# Altium schematic sheet Power.SchDoc
size A3; SheetNumber: 3; SheetTotal: 10
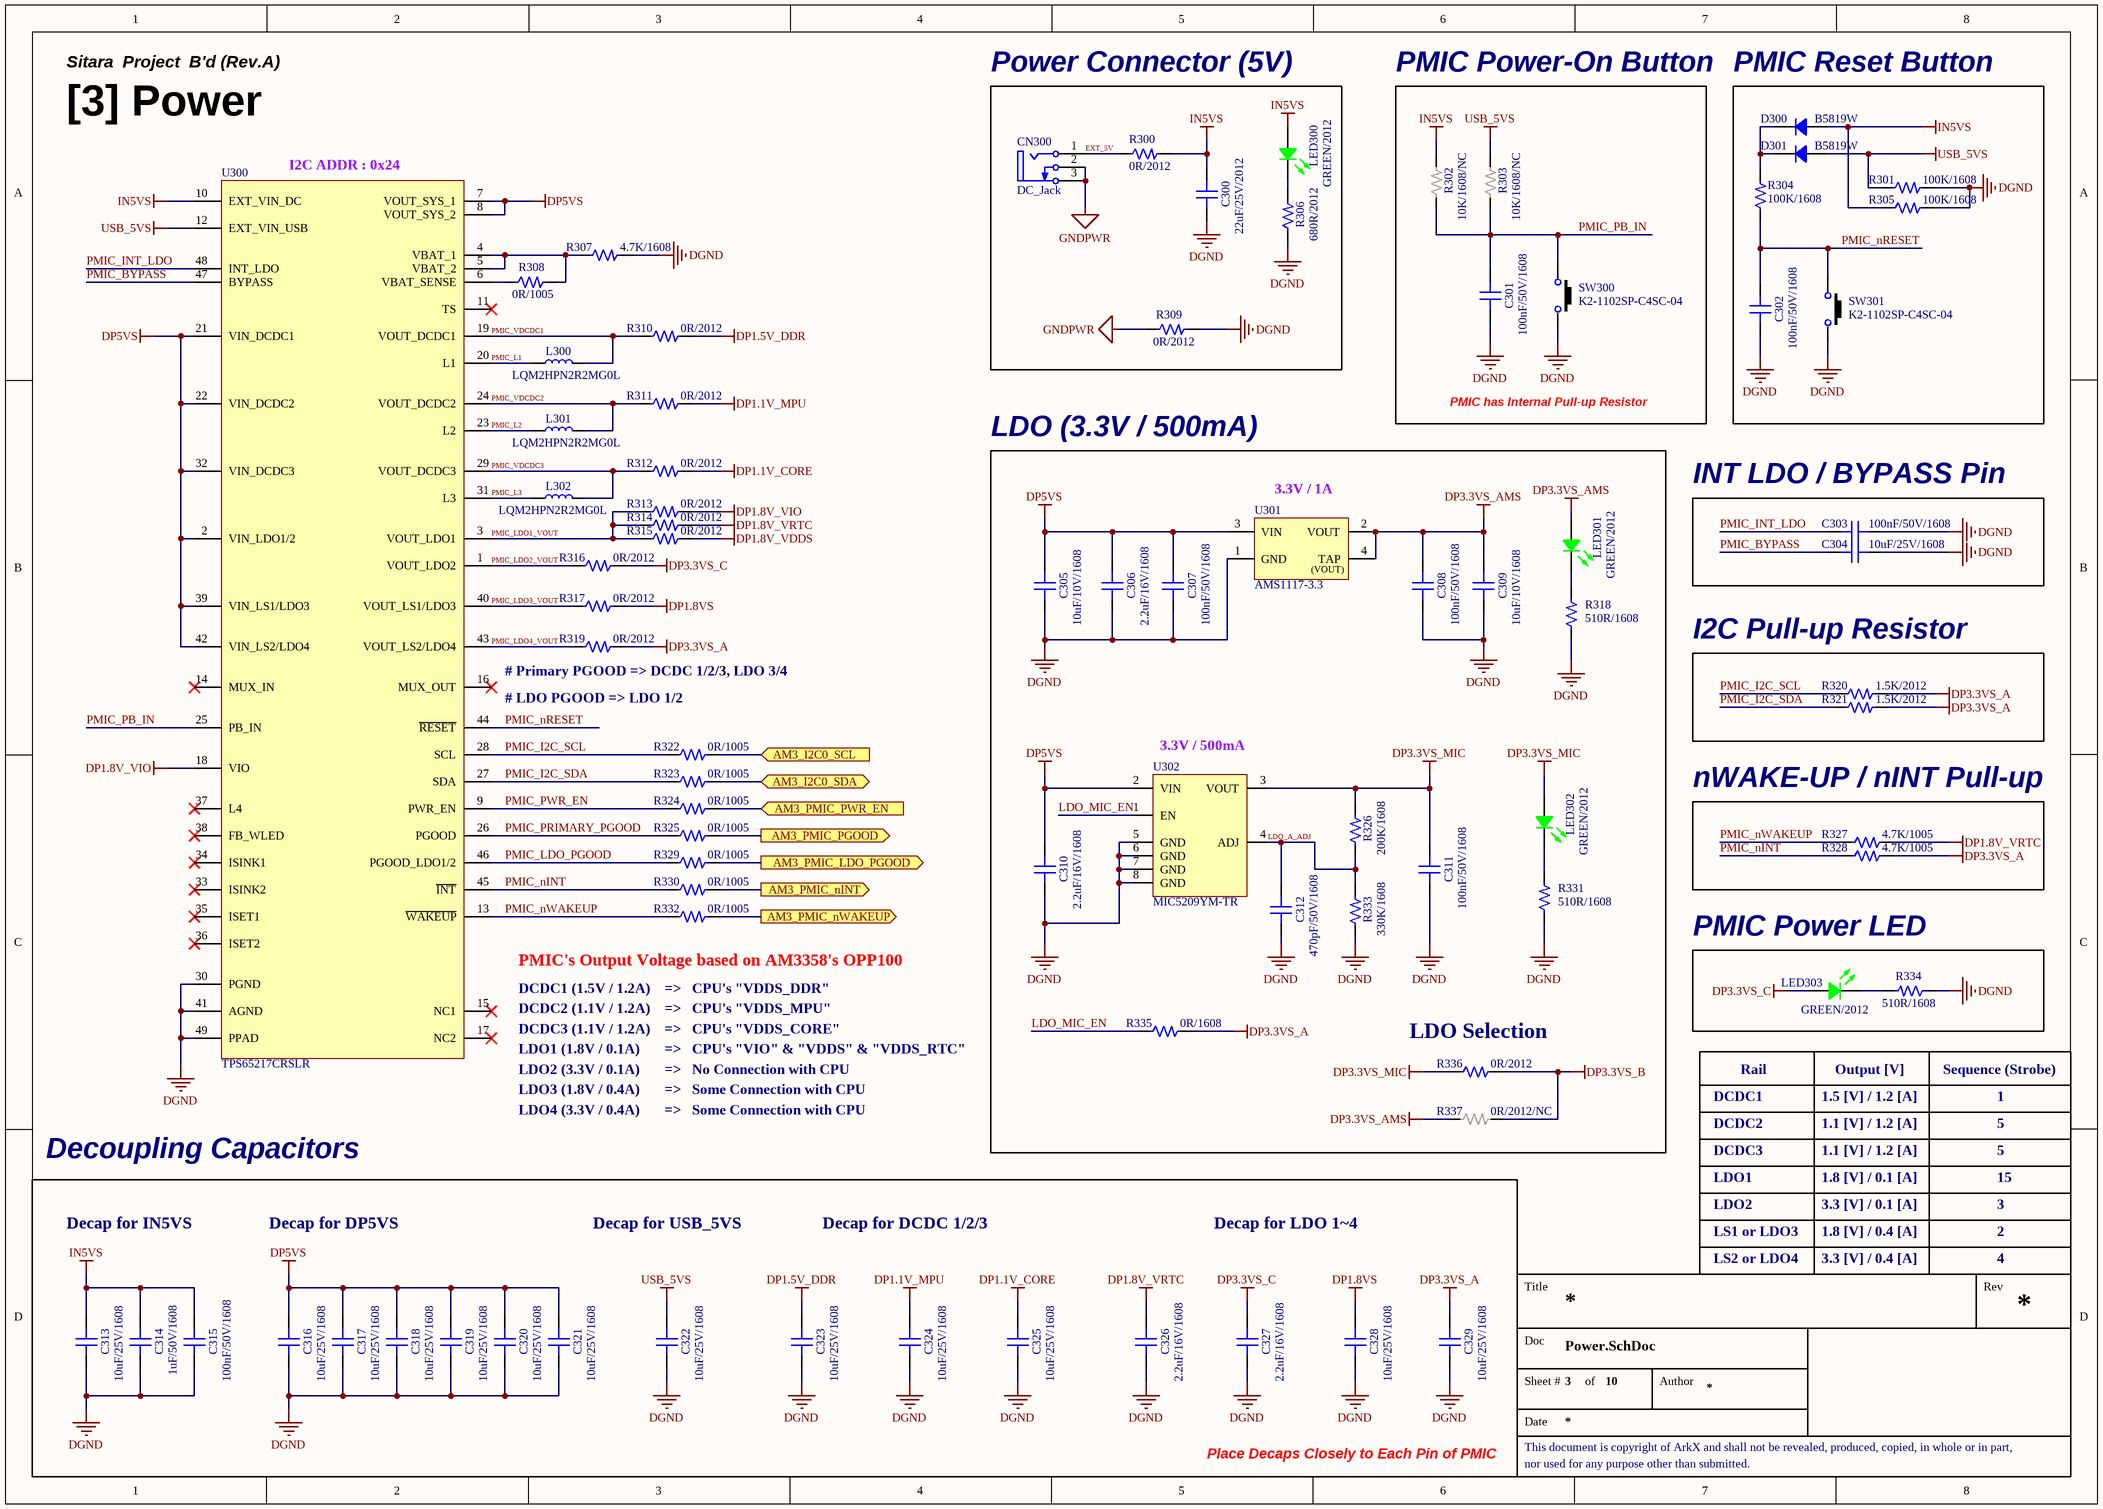
[diagram p0: Power.SchDoc]

## Parts
C300  22uF/25V/2012  [CAP 2012 (0805_INCH)]
C301  100nF/50V/1608  [CAP 1608 (0603_INCH)]
C302  100nF/50V/1608  [CAP 1608 (0603_INCH)]
C303  100nF/50V/1608  [CAP 1608 (0603_INCH)]
C304  10uF/25V/1608  [CAP 1608 (0603_INCH)]
C305  10uF/10V/1608  [CAP 1608 (0603_INCH)]
C306  2.2uF/16V/1608  [CAP 1608 (0603_INCH)]
C307  100nF/50V/1608  [CAP 1608 (0603_INCH)]
C308  100nF/50V/1608  [CAP 1608 (0603_INCH)]
C309  10uF/10V/1608  [CAP 1608 (0603_INCH)]
C310  2.2uF/16V/1608  [CAP 1608 (0603_INCH)]
C311  100nF/50V/1608  [CAP 1608 (0603_INCH)]
C312  470pF/50V/1608  [CAP 1608 (0603_INCH)]
C313  10uF/25V/1608  [CAP 1608 (0603_INCH)]
C314  1uF/50V/1608  [CAP 1608 (0603_INCH)]
C315  100nF/50V/1608  [CAP 1608 (0603_INCH)]
C316  10uF/25V/1608  [CAP 1608 (0603_INCH)]
C317  10uF/25V/1608  [CAP 1608 (0603_INCH)]
C318  10uF/25V/1608  [CAP 1608 (0603_INCH)]
C319  10uF/25V/1608  [CAP 1608 (0603_INCH)]
C320  10uF/25V/1608  [CAP 1608 (0603_INCH)]
C321  10uF/25V/1608  [CAP 1608 (0603_INCH)]
C322  10uF/25V/1608  [CAP 1608 (0603_INCH)]
C323  10uF/25V/1608  [CAP 1608 (0603_INCH)]
C324  10uF/25V/1608  [CAP 1608 (0603_INCH)]
C325  10uF/25V/1608  [CAP 1608 (0603_INCH)]
C326  2.2uF/16V/1608  [CAP 1608 (0603_INCH)]
C327  2.2uF/16V/1608  [CAP 1608 (0603_INCH)]
C328  10uF/25V/1608  [CAP 1608 (0603_INCH)]
C329  10uF/25V/1608  [CAP 1608 (0603_INCH)]
CN300  DC_Jack  [CON_DC-JACK]
D300  B5819W  [DIO_SOD-123]
D301  B5819W  [DIO_SOD-123]
L300  LQM2HPN2R2MG0L  [IND_LQM2HPN2R2MG0L]
L301  LQM2HPN2R2MG0L  [IND_LQM2HPN2R2MG0L]
L302  LQM2HPN2R2MG0L  [IND_LQM2HPN2R2MG0L]
LED300  GREEN/2012  [LED MHT170RGBCT (GREEN)]
LED301  GREEN/2012  [LED MHT170RGBCT (GREEN)]
LED302  GREEN/2012  [LED MHT170RGBCT (GREEN)]
LED303  GREEN/2012  [LED MHT170RGBCT (GREEN)]
R300  0R/2012  [RES 2012 (0805_inch)]
R301  100K/1608  [RES 1608 (0603_inch)]
R302  10K/1608/NC  [RES 1608 (0603_inch)/NC]
R303  10K/1608/NC  [RES 1608 (0603_inch)/NC]
R304  100K/1608  [RES 1608 (0603_inch)]
R305  100K/1608  [RES 1608 (0603_inch)]
R306  680R/2012  [RES 2012 (0805_inch)]
R307  4.7K/1608  [RES 1608 (0603_inch)]
R308  0R/1005  [RES 1005 (0402_inch)]
R309  0R/2012  [RES 2012 (0805_inch)]
R310  0R/2012  [RES 2012 (0805_inch)]
R311  0R/2012  [RES 2012 (0805_inch)]
R312  0R/2012  [RES 2012 (0805_inch)]
R313  0R/2012  [RES 2012 (0805_inch)]
R314  0R/2012  [RES 2012 (0805_inch)]
R315  0R/2012  [RES 2012 (0805_inch)]
R316  0R/2012  [RES 2012 (0805_inch)]
R317  0R/2012  [RES 2012 (0805_inch)]
R318  510R/1608  [RES 1608 (0603_inch)]
R319  0R/2012  [RES 2012 (0805_inch)]
R320  1.5K/2012  [RES 2012 (0805_inch)]
R321  1.5K/2012  [RES 2012 (0805_inch)]
R322  0R/1005  [RES 1005 (0402_inch)]
R323  0R/1005  [RES 1005 (0402_inch)]
R324  0R/1005  [RES 1005 (0402_inch)]
R325  0R/1005  [RES 1005 (0402_inch)]
R326  200K/1608  [RES 1608 (0603_inch)]
R327  4.7K/1005  [RES 1005 (0402_inch)]
R328  4.7K/1005  [RES 1005 (0402_inch)]
R329  0R/1005  [RES 1005 (0402_inch)]
R330  0R/1005  [RES 1005 (0402_inch)]
R331  510R/1608  [RES 1608 (0603_inch)]
R332  0R/1005  [RES 1005 (0402_inch)]
R333  330K/1608  [RES 1608 (0603_inch)]
R334  510R/1608  [RES 1608 (0603_inch)]
R335  0R/1608  [RES 1608 (0603_inch)]
R336  0R/2012  [RES 2012 (0805_inch)]
R337  0R/2012/NC  [RES 2012 (0805_INCH)/NC]
SW300  K2-1102SP-C4SC-04  [SW K2-1102SP-C4SC-04]
SW301  K2-1102SP-C4SC-04  [SW K2-1102SP-C4SC-04]
U300  TPS65217CRSLR  [IC_VQFN-48(6x6)]
U301  AMS1117-3.3  [SOT 223-3 (DIODES INCORPORATED)]
U302  MIC5209YM-TR  [IC_SOIC-8 (4.90x3.90mm)]

## Blocks framed on the sheet
Power Connector (5V): C300 CN300 LED300 R300 R306 R309
PMIC Power-On Button: C301 R302 R303 SW300
PMIC Reset Button: C302 D300 D301 R301 R304 R305 SW301
LDO (3.3V / 500mA): C305-C312 LED301 LED302 R318 R326 R331 R333 R335-R337 U301 U302
INT LDO / BYPASS Pin: C303 C304
I2C Pull-up Resistor: R320 R321
nWAKE-UP / nINT Pull-up: R327 R328
PMIC Power LED: LED303 R334
Decoupling Capacitors: C313-C329

## Ports
AM3_I2C0_SCL (in, see Sitara_IO_Bank_6[2B], Sitara_IO_Bank_123[4A]), AM3_I2C0_SDA (bidir, see Sitara_IO_Bank_6[2B], Sitara_IO_Bank_123[4A]), AM3_PMIC_LDO_PGOOD (out, see Sitara_AUX[2B]), AM3_PMIC_nINT (out, see Sitara_IO_Bank_6[2A]), AM3_PMIC_nWAKEUP (out, see Sitara_AUX[2A]), AM3_PMIC_PGOOD (out, see Sitara_IO_Bank_6[2A], Sitara_IO_Bank_6[3B]), AM3_PMIC_PWR_EN (in, see Sitara_AUX[2A])

## Nets
DGND: C300.1 C301.1 C302.1 C303.1 C304.2 C305.1 C306.1 C307.1 C308.1 C309.1 C310.1 C311.1 C312.1 C313.1 C314.1 C315.1 C316.1 C317.1 C318.1 C319.1 C320.1 C321.1 C322.1 C323.1 C324.1 C325.1 C326.1 C327.1 C328.1 C329.1 R301.2 R305.2 R306.1 R307.2 R309.2 R318.1 R331.1 R333.1 R334.1 SW300.3 SW301.3 U300.30(PGND) U300.41(AGND) U300.49(PPAD) U301.1(GND) U302.5(GND) U302.6(GND) U302.7(GND) U302.8(GND)
DP1.1V_CORE: C325.2 R312.2
DP1.1V_MPU: C324.2 R311.2
DP1.5V_DDR: C323.2 R310.2
DP1.8V_VDDS: R315.2
DP1.8V_VIO: R313.2 U300.18(VIO)
DP1.8V_VRTC: C326.2 R314.2 R327.2
DP1.8VS: C328.2 R317.2
DP3.3VS_A: C329.2 R319.2 R320.2 R321.2 R328.2 R335.2
DP3.3VS_AMS: C308.2 C309.2 LED301.4(Common_Anode) R337.1 U301.2(VOUT) U301.4(TAP)
DP3.3VS_B: R336.2 R337.2
DP3.3VS_C: C327.2 LED303.4(Common_Anode) R316.2
DP3.3VS_MIC: C311.2 LED302.4(Common_Anode) R326.2 R336.1 U302.3(VOUT)
DP5VS: C305.2 C306.2 C307.2 C310.2 C316.2 C317.2 C318.2 C319.2 C320.2 C321.2 U300.2(VIN_LDO1/2) U300.7(VOUT_SYS_1) U300.8(VOUT_SYS_2) U300.21(VIN_DCDC1) U300.22(VIN_DCDC2) U300.32(VIN_DCDC3) U300.39(VIN_LS1/LDO3) U300.42(VIN_LS2/LDO4) U301.3(VIN) U302.2(VIN)
GNDPWR: CN300.2(GND) CN300.3(GND) R309.1
IN5VS: C300.2 C313.2 C314.2 C315.2 D300.1 LED300.4(Common_Anode) R300.2 R302.2 R305.1 U300.10(EXT_VIN_DC)
USB_5VS: C322.2 D301.1 R301.1 R303.2 U300.12(EXT_VIN_USB)
AM3_I2C0_SCL: R322.2 ; port AM3_I2C0_SCL
AM3_I2C0_SDA: R323.2 ; port AM3_I2C0_SDA
AM3_PMIC_LDO_PGOOD: R329.2 ; port AM3_PMIC_LDO_PGOOD
AM3_PMIC_nINT: R330.2 ; port AM3_PMIC_nINT
AM3_PMIC_nWAKEUP: R332.2 ; port AM3_PMIC_nWAKEUP
AM3_PMIC_PGOOD: R325.2 ; port AM3_PMIC_PGOOD
AM3_PMIC_PWR_EN: R324.2 ; port AM3_PMIC_PWR_EN
EXT_5V: CN300.1(VCC) R300.1
LDO_A_ADJ: C312.2 R326.1 R333.2 U302.4(ADJ)
LDO_MIC_EN: R335.1 U302.1(EN)
PMIC_BYPASS: C304.1 U300.47(BYPASS)
PMIC_I2C_SCL: R320.1 R322.1 U300.28(SCL)
PMIC_I2C_SDA: R321.1 R323.1 U300.27(SDA)
PMIC_INT_LDO: C303.2 U300.48(INT_LDO)
PMIC_L1: L300.1 U300.20(L1)
PMIC_L2: L301.1 U300.23(L2)
PMIC_L3: L302.1 U300.31(L3)
PMIC_LDO1_VOUT: R313.1 R314.1 R315.1 U300.3(VOUT_LDO1)
PMIC_LDO2_VOUT: R316.1 U300.1(VOUT_LDO2)
PMIC_LDO3_VOUT: R317.1 U300.40(VOUT_LS1/LDO3)
PMIC_LDO4_VOUT: R319.1 U300.43(VOUT_LS2/LDO4)
PMIC_LDO_PGOOD: R329.1 U300.46(PGOOD_LDO1/2)
PMIC_nINT: R328.1 R330.1 U300.45(~{INT})
PMIC_nRESET: C302.2 R304.1 SW301.1 U300.44(~{RESET})
PMIC_nWAKEUP: R327.1 R332.1 U300.13(~{WAKEUP})
PMIC_PB_IN: C301.2 R302.1 R303.1 SW300.1 U300.25(PB_IN)
PMIC_PRIMARY_PGOOD: R325.1 U300.26(PGOOD)
PMIC_PWR_EN: R324.1 U300.9(PWR_EN)
PMIC_VDCDC1: L300.2 R310.1 U300.19(VOUT_DCDC1)
PMIC_VDCDC2: L301.2 R311.1 U300.24(VOUT_DCDC2)
PMIC_VDCDC3: L302.2 R312.1 U300.29(VOUT_DCDC3)
NetD300_2: D300.2 D301.2 R304.2
NetLED300_2: LED300.2(GREEN) R306.2
NetLED301_2: LED301.2(GREEN) R318.2
NetLED302_2: LED302.2(GREEN) R331.2
NetLED303_2: LED303.2(GREEN) R334.2
NetR307_1: R307.1 R308.2 U300.4(VBAT_1) U300.5(VBAT_2)
NetR308_1: R308.1 U300.6(VBAT_SENSE)

Not connected (* = marked no-connect by the designer): U300 11(TS)* 14(MUX_IN)* 15(NC1)* 16(MUX_OUT)* 17(NC2)* 33(ISINK2)* 34(ISINK1)* 35(ISET1)* 36(ISET2)* 37(L4)* 38(FB_WLED)*

## Notes on the sheet
- Sitara  Project  B'd (Rev.A)
- [3] Power
- (near U300) I2C ADDR : 0x24
- PMIC has Internal Pull-up Resistor
- (near U301) 3.3V / 1A
- # LDO PGOOD => LDO 1/2
- (near R319) # Primary PGOOD => DCDC 1/2/3, LDO 3/4
- (near U302) 3.3V / 500mA
- DCDC1 (1.5V / 1.2A)    =>   CPU's "VDDS_DDR"
- PMIC's Output Voltage based on AM3358's OPP100
- DCDC2 (1.1V / 1.2A)    =>   CPU's "VDDS_MPU"
- DCDC3 (1.1V / 1.2A)    =>   CPU's "VDDS_CORE"
- LDO1 (1.8V / 0.1A)       =>   CPU's "VIO" & "VDDS" & "VDDS_RTC"
- (near R336) LDO Selection
- LDO2 (3.3V / 0.1A)       =>   No Connection with CPU
- LDO3 (1.8V / 0.4A)       =>   Some Connection with CPU
- LDO4 (3.3V / 0.4A)       =>   Some Connection with CPU
- DCDC1
- DCDC2
- Rail
- 1.5 [V] / 1.2 [A]
- 1.1 [V] / 1.2 [A]
- Output [V]
- Sequence (Strobe)
- 1
- 5
- DCDC3
- LDO1
- 1.8 [V] / 0.1 [A]
- 15
- Decap for IN5VS
- Decap for DP5VS
- Decap for USB_5VS
- Decap for DCDC 1/2/3
- Decap for LDO 1~4
- LDO2
- LS1 or LDO3
- LS2 or LDO4
- 3.3 [V] / 0.1 [A]
- 1.8 [V] / 0.4 [A]
- 3.3 [V] / 0.4 [A]
- 3
- 2
- 4
- Place Decaps Closely to Each Pin of PMIC
- Title
- Rev
- Doc
- Sheet #
- of
- Author
- This document is copyright of ArkX and shall not be revealed, produced, copied, in whole or in part,
- Date
- nor used for any purpose other than submitted.
- (in symbol IC_REG_AMS1117-3.3) (VOUT)

## Library data of the parts
C300 = CAP_22uF/25V/2012: Ceramic CAP_22uF/25V/2012; LCSC Part #: C45783; JLCPCB Part Type: Basic Part
C301-C303 C307 C308 C311 C315 = CAP_100nF/50V/1608: Ceramic CAP_100nF/50V/1608; LCSC Part #: C14663; JLCPCB Part Type: Basic Part
C304 C313 C316-C325 C328 C329 = CAP_10uF/25V/1608: Ceramic CAP_10uF/25V/1608; LCSC Part #: C96446; JLCPCB Part Type: Basic Part
C305 C309 = CAP_10uF/10V/1608: Ceramic CAP_10uF/10V/1608; LCSC Part #: C19702; JLCPCB Part Type: Basic Part
C306 C310 C326 C327 = CAP_2.2uF/16V/1608: Ceramic CAP_2.2uF/16V/1608; LCSC Part #: C23630; JLCPCB Part Type: Basic Part
C312 = CAP_470pF/50V/1608: Ceramic CAP_470pF/50V/1608; LCSC Part #: C1620; JLCPCB Part Type: Basic Part
C314 = CAP_1uF/50V/1608: Ceramic CAP_1uF/50V/1608; LCSC Part #: C15849; JLCPCB Part Type: Basic Part
CN300 = CON_DC-Jack: ComponentLink1Description: Manufacturer Link; ComponentLink1URL: http://www.cliffuk.co.uk/
D300 D301 = DIO_B5819W: 40V 600mV@1A 1A SOD-123  Schottky Barrier Diodes (SBD) ROHS; LCSC Part #: C8598; JLCPCB Part Type: Basic Part
L300-L302 = IND_LQM2HPN2R2MG0L: 2.2 µH Shielded Multilayer Inductor 1.3 A 100mOhm Max 1008 (2520 Metric); LCSC Part #: C86092; JLCPCB Part Type: Extended Part
LED300-LED303 = LED_MHT170RGBCT(GREEN): Colorless transparence -30℃~+85℃ Positive post Common anode RGB 120° 0805  Light Emitting Diodes (LED) ROHS; LCSC Part #: C2962094; JLCPCB Part Type: Extended Part
R300 R309-R317 R319 R336 = RES_0R/2012/0.125W: Value: 0R; Power Rating: 0.125W; Precision: 1%; Size: 2012; LCSC Part #: C17477; JLCPCB Part Type: Basic Part
R301 R304 R305 = RES_100K/1608/0.1W: Value: 100K; Power Rating: 0.1W; Precision: 1%; Size: 1608; LCSC Part #: C25803; JLCPCB Part Type: Basic Part
R302 R303 = RES_NC_10K/1608/0.1W: RES_10K/1608/0.1W; Value: 10K; Power Rating: 0.1W; Precision: 1%; Size: 1608
R306 = RES_680R/2012/0.125W: Value: 680R; Power Rating: 0.125W; Precision: 1%; Size: 2012; LCSC Part #: C17798; JLCPCB Part Type: Basic Part
R307 = RES_4.7K/1608/0.1W: Value: 4.7K; Power Rating: 0.1W; Precision: 1%; Size: 1608; LCSC Part #: C23162; JLCPCB Part Type: Basic Part
R308 R322-R325 R329 R330 R332 = RES_0R/1005/62.5mW: Value: 0R; Power Rating: 62.5mW; Precision: 1%; Size: 1005; LCSC Part #: C17168; JLCPCB Part Type: Basic Part
R318 R331 R334 = RES_510R/1608/0.1W: Value: 510R; Power Rating: 0.1W; Precision: 1%; Size: 1608; LCSC Part #: C23193; JLCPCB Part Type: Basic Part
R320 R321 = RES_1.5K/2012/0.125W: Value: 1.5K; Power Rating: 0.125W; Precision: 1%; Size: 2012; LCSC Part #: C4310; JLCPCB Part Type: Basic Part
R326 = RES_200K/1608/0.1W: Value: 200K; Power Rating: 0.1W; Precision: 1%; Size: 1608; LCSC Part #: C25811; JLCPCB Part Type: Basic Part
R327 R328 = RES_4.7K/1005/62.5mW: Value: 4.7K; Power Rating: 62.5mW; Precision: 1%; Size: 1005; LCSC Part #: C25900; JLCPCB Part Type: Basic Part
R333 = RES_330K/1608/0.1W: Value: 330K; Power Rating: 0.1W; Precision: 1%; Size: 1608; LCSC Part #: C23137; JLCPCB Part Type: Basic Part
R335 = RES_0R/1608/0.1W: Value: 0R; Power Rating: 0.1W; Precision: 1%; Size: 1608; LCSC Part #: C21189; JLCPCB Part Type: Basic Part
R337 = RES_NC_0R/2012/0.125W: 0R/2012/0.125W/NC; Value: 0R; Power Rating: 0.1W; Precision: 1%; Size: 1608
SW300 SW301 = SW_K2-1102SP-C4SC-04(2P): -25℃~+85℃ 6mm 5mm Round Button 50mA Brick nogging 6mm SPST 100MΩ 100000 250gf@±30gf 12V SMD  Tactile Switches ROHS; LCSC Part #: C127509; JLCPCB Part Type: Extended Part
U300 = IC_PMIC_TPS65217CRSLR: Battery Management, Display (LED Drivers), Handheld/Mobile Devices, Power Supply PMIC 48-VQFN (6x6); LCSC Part #: C116081; JLCPCB Part Type: Extended Part
U301 = IC_REG_AMS1117-3.3: 72dB@(120Hz) 1A 1.3V@(800mA) Fixed 3.3V~3.3V Positive 1 SOT-223  Linear Voltage Regulators (LDO) ROHS; LCSC Part #: C6186; JLCPCB Part Type: Basic Part
U302 = IC_REG_MIC5209YM-TR: Linear Voltage Regulator IC Positive Adjustable 1 Output 500mA 8-SOIC; LCSC Part #: C461593; JLCPCB Part Type: Extended Part